# Altium project StenoBoard_R.PrjPcb
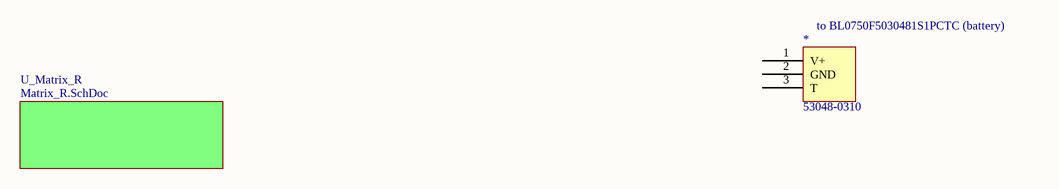
[diagram p0: Master.SchDoc]
2 sheets, 1 parts. Net scope: global (net labels, ports and power ports of the same name join across sheets).
Sheets:
  Master.SchDoc
    U_Matrix_R = Matrix_R.SchDoc

## Sheet Master.SchDoc
size A; SheetNumber: 1; SheetTotal: 2

### Parts
*  53048-0310  [MAXM-P8-1]

### Sub-sheets
U_Matrix_R = Matrix_R.SchDoc: no entries

### Nets

Not connected (* = marked no-connect by the designer): * 1(V+) 2(GND) 3(T)

### Notes on the sheet
- (near *) to BL0750F5030481S1PCTC (battery)

### Library data of the parts
* = CMP-002-00074-1: Board Connector, 3 Contact(s), 1 Row(s), Male, Right Angle, 0.049 inch Pitch, Solder Terminal, Locking, Natural Insulator, Receptacle; Connector Type: BOARD CONNECTOR; Mounting Technology: Board; RoHS Compliant: Yes; Max Operating Temperature: 85°C; Min Operating Temperature: -40°C

## Sheet Matrix_R.SchDoc
size A; SheetNumber: 2; SheetTotal: 2